# EAGLE design init_test_hall (EAGLE 8.2.2)
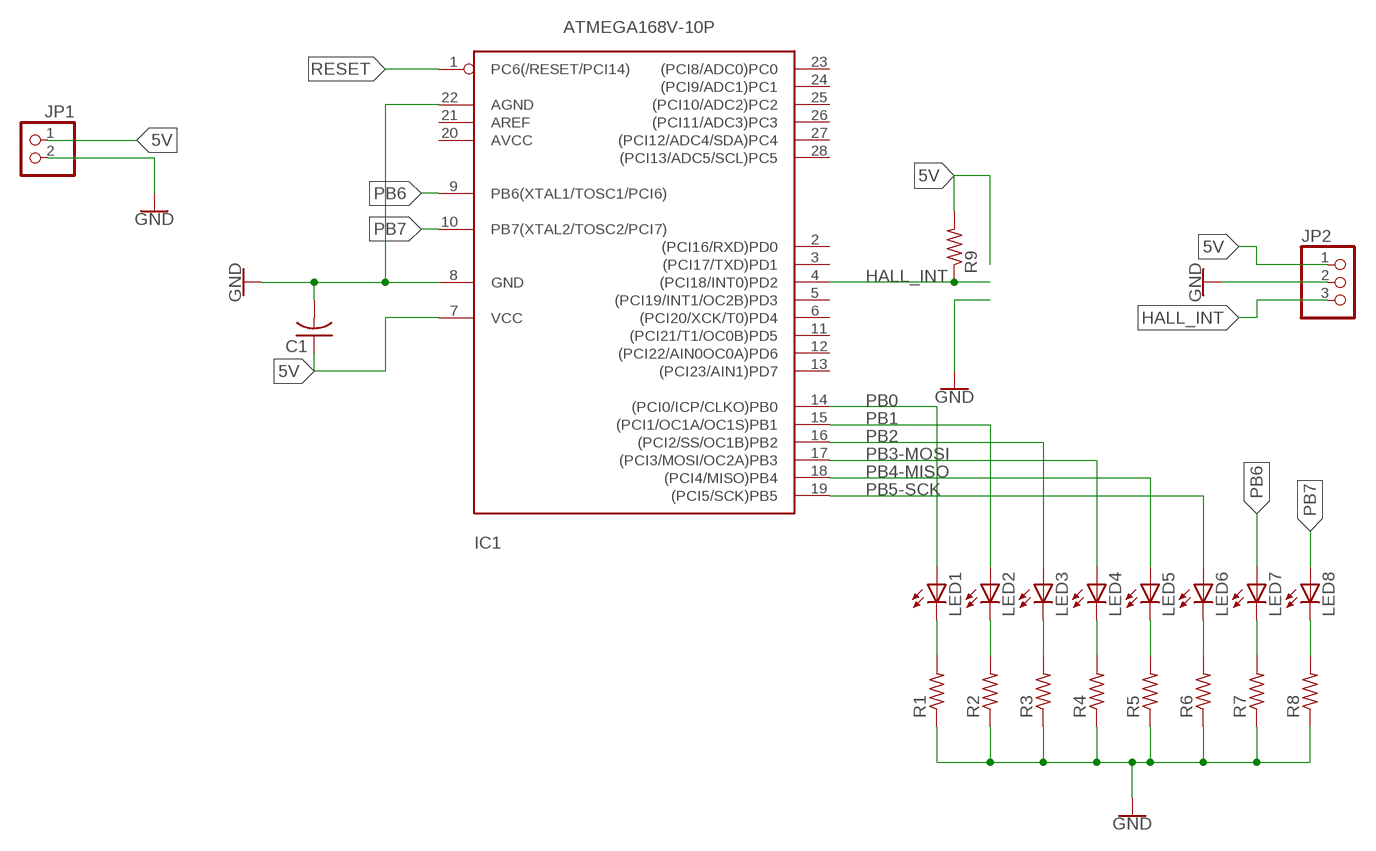
[diagram p0: schematic, sheet 1]

## Parts
C1  C-US025-030X050  [C025-030X050]
IC1  ATMEGA168V-10P  [DIL28-3]
JP1  PINHD-1X2  [1X02]
JP2  PINHD-1X3  [1X03]
LED1  LED3MM  [LED3MM]
LED2  LED3MM  [LED3MM]
LED3  LED3MM  [LED3MM]
LED4  LED3MM  [LED3MM]
LED5  LED3MM  [LED3MM]
LED6  LED3MM  [LED3MM]
LED7  LED3MM  [LED3MM]
LED8  LED3MM  [LED3MM]
R1  R-US_0207/7  [0207/7]
R2  R-US_0207/7  [0207/7]
R3  R-US_0207/7  [0207/7]
R4  R-US_0207/7  [0207/7]
R5  R-US_0207/7  [0207/7]
R6  R-US_0207/7  [0207/7]
R7  R-US_0207/7  [0207/7]
R8  R-US_0207/7  [0207/7]
R9  R-US_0207/7  [0207/7]

## Nets
5V: C1.1 IC1.7(VCC) JP1.1 JP2.1 R9.2
GND: C1.2 IC1.8(GND) IC1.22(AGND) JP1.2 JP2.2 R1.1 R2.1 R3.1 R4.1 R5.1 R6.1 R7.1 R8.1
HALL_INT: IC1.4((PCI18/INT0)PD2) JP2.3 R9.1
N$1: LED1.K(C) R1.2
N$2: LED2.K(C) R2.2
N$3: LED3.K(C) R3.2
N$4: LED4.K(C) R4.2
N$5: LED5.K(C) R5.2
N$6: LED6.K(C) R6.2
N$7: LED7.K(C) R7.2
N$8: LED8.K(C) R8.2
PB0: IC1.14((PCI0/ICP/CLKO)PB0) LED1.A
PB1: IC1.15((PCI1/OC1A/OC1S)PB1) LED2.A
PB2: IC1.16((PCI2/SS/OC1B)PB2) LED3.A
PB3-MOSI: IC1.17((PCI3/MOSI/OC2A)PB3) LED4.A
PB4-MISO: IC1.18((PCI4/MISO)PB4) LED5.A
PB5-SCK: IC1.19((PCI5/SCK)PB5) LED6.A
PB6: IC1.9(PB6(XTAL1/TOSC1/PCI6)) LED7.A
PB7: IC1.10(PB7(XTAL2/TOSC2/PCI7)) LED8.A
RESET: IC1.1(PC6(/RESET/PCI14))
Unconnected: IC1.2((PCI16/RXD)PD0) IC1.3((PCI17/TXD)PD1) IC1.5((PCI19/INT1/OC2B)PD3) IC1.6((PCI20/XCK/T0)PD4) IC1.11((PCI21/T1/OC0B)PD5) IC1.12((PCI22/AIN0OC0A)PD6) IC1.13((PCI23/AIN1)PD7) IC1.20(AVCC) IC1.21(AREF) IC1.23((PCI8/ADC0)PC0) IC1.24((PCI9/ADC1)PC1) IC1.25((PCI10/ADC2)PC2) IC1.26((PCI11/ADC3)PC3) IC1.27((PCI12/ADC4/SDA)PC4) IC1.28((PCI13/ADC5/SCL)PC5)

## Library data of the parts
C1 = adafruit:C-US: CAPACITOR, American symbol
IC1 = adafruit:ATMEGA168*P: MICROCONTROLLER 16 kBytes FLASH 1 kBytes SRAM 512 Bytes EEPROM USART 8-channel 10 bit ADC
JP1 = pinhead:PINHD-1X2: PIN HEADER
JP2 = pinhead:PINHD-1X3: PIN HEADER
LED1-LED8 = adafruit:LED: LED OSRAM: - CHIPLED LG R971, LG N971, LY N971, LG Q971, LY Q971, LO R971, LY R971 LH N974, LH R974 LS Q976, LO Q976, LY Q976 LO Q996 - Hyper CHIPLED LW Q18S LB Q993, LB Q99A, LB R99A - SideLED LS A670, LO A670, LY A670, LG A670, LP A670 LB A673, LV A673, LT A673, LW A673 LH A674 LY A675 LS A676, LA A676, LO A676, LY A676, LW A676 LS A679, LY A679, LG A679 - Hyper Micro SIDELED® LS Y876, LA Y876, LO Y876, LY Y876 LT Y87S - SmartLED LW L88C, LW L88S LB L89C, LB L89S, LG L890 LS L89K, LO L89K, LY L89K LS L896, LA L896, LO L896, LY L896 - TOPLED LS T670, LO T670, LY T670, LG T670, LP T670 LSG T670, LSP T670, LSY T670, LOP T670, LYG T670 LG T671, LOG T671, LSG T671 LB T673, LV T673, LT T673, LW T673 LH T674 LS T676, LA T676, LO T676, LY T676, LB T676, LH T676, LSB T676, LW T676 LB T67C, LV T67C, LT T67C, LS T67K, LO T67K, LY T67K, LW E67C LS E67B, LA E67B, LO E67B, LY E67B, LB E67C, LV E67C, LT E67C LW T67C LS T679, LY T679, LG T679 LS T770, LO T770, LY T770, LG T770, LP T770 LB T773, LV T773, LT T773, LW T773 LH T774 LS E675, LA E675, LY E675, LS T675 LS T776, LA T776, LO T776, LY T776, LB T776 LHGB T686 LT T68C, LB T68C - Hyper Mini TOPLED® LB M676 - Mini TOPLED Santana® LG M470 LS M47K, LO M47K, LY M47K Source: http://www.osram.convergy.de/
R1-R9 = adafruit:R-US_: RESISTOR, American symbol

## Board
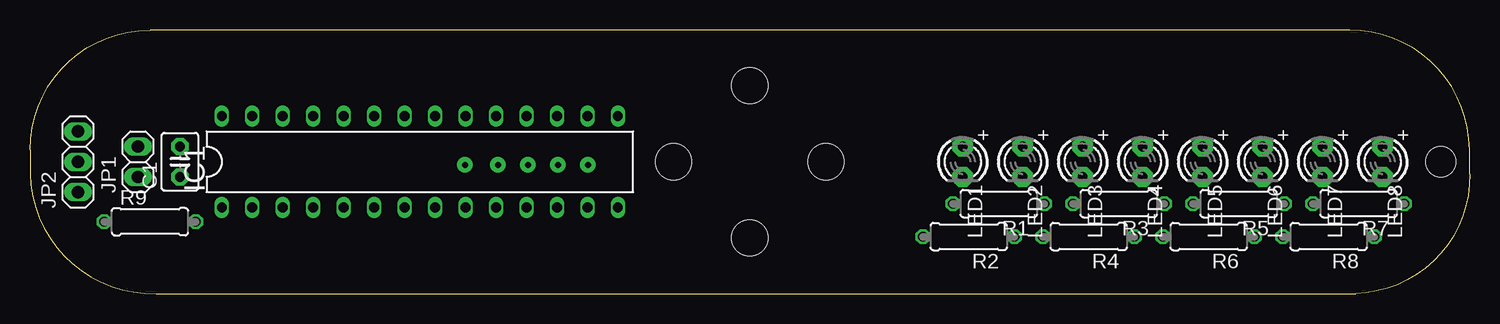
[diagram p1: board, top side]
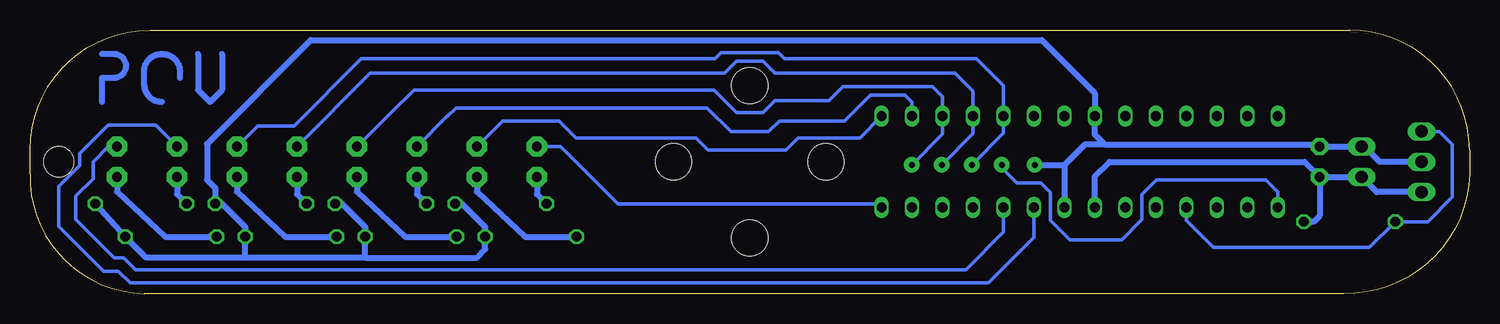
[diagram p2: board, bottom side, seen from below]

Size 120 x 22 mm. Coordinates in mm from the lower left corner, seen from the top.
Outline: 10.5,0 110.5,0 arc90 120,10 120,12 arc90 110,22 10,22 arc90 0,12 0,10 arc90 10.5,0
Copper layers (1*16): Top 0.035mm / dielectric 1.5mm / Bottom 0.035mm
Design rules "OthermillDRC_1_64_v2": minimum track width 16mil, minimum drill 31mil, track to track 0.39878125mm, track to pad 0.39878125mm, pad to pad 0.39878125mm, via to via 0.39878125mm, smd to smd 0mil, copper to edge 0mil, drill to drill 1mil, minimum pad ring 0mil, minimum via ring 15mil, stop-mask expansion 1mil, vias tented up to drill 30mil, thermal gap 10mil
Holes 3 mm at 60,4.65 60,17.35 66.35,11 53.65,11
Holes 2.5 mm at 117.6,11

### Footprints (pad centres in the part's own frame; a part is rotated, then mirrored left to right if it is on the bottom)
C025-030X050 = drill 0.813 pad 1.422 octagon: 1 -1.27,0; 2 1.27,0
DIL28-3 = drill 0.813 long: 1 -16.51,-3.81; 2 -13.97,-3.81; 3 -11.43,-3.81; 4 -8.89,-3.81; 5 -6.35,-3.81; 6 -3.81,-3.81; 7 -1.27,-3.81; 8 1.27,-3.81; 9 3.81,-3.81; 10 6.35,-3.81; 11 8.89,-3.81; 12 11.43,-3.81; 13 13.97,-3.81; 14 16.51,-3.81; 15 16.51,3.81; 16 13.97,3.81; 17 11.43,3.81; 18 8.89,3.81; 19 6.35,3.81; 20 3.81,3.81; 21 1.27,3.81; 22 -1.27,3.81; 23 -3.81,3.81; 24 -6.35,3.81; 25 -8.89,3.81; 26 -11.43,3.81; 27 -13.97,3.81; 28 -16.51,3.81
1X02 = drill 1.016 long: 1 -1.27,0; 2 1.27,0
1X03 = drill 1.016 long: 1 -2.54,0; 2 0,0; 3 2.54,0
LED3MM = drill 0.813 pad 1.676 octagon: A -1.27,0; K 1.27,0
0207/7 = drill 0.813 octagon: 1 -3.81,0; 2 3.81,0

### Placement (x,y rotation side)
C1  12.5,11 90 top
IC1  32.5,11 0 top
JP1  9,11 90 top
JP2  4,11 90 top
LED1  77.75,11 270 top
LED2  82.75,11 270 top
LED3  87.75,11 270 top
LED4  92.75,11 270 top
LED5  97.75,11 270 top
LED6  102.75,11 270 top
LED7  107.75,11 270 top
LED8  112.75,11 270 top
R1  80.75,7.5 180 top
R2  78.25,4.75 180 top
R3  90.75,7.5 180 top
R4  88.25,4.75 180 top
R5  100.75,7.5 180 top
R6  98.25,4.75 180 top
R7  110.75,7.5 180 top
R8  108.25,4.75 180 top
R9  10,6 0 top

### Tracks (layer width: path | path; a pad name or v marks a point on that pad's centre or on a via)
5V
  Bottom 0.508: C1.1 JP1.1 7.73,8.46 JP2.1 | C1.1 12.5,6.5 13,6 R9.2 | 31.23,7.77 IC1.7 31.23,9.77 30,11 13.77,11 C1.1
GND  (via drill 0.5)
  Bottom 0.508: 33.77,10.72 IC1.8 | 33.77,10.72 33.77,10.73 | JP2.2 7.5,11 8.77,12.27 JP1.2 C1.2 12.67,12.44 30.38,12.44 | v36.25,10.75 33.8,10.75 33.77,10.72 | R7.1 R8.1 110.31,3 102.02,3 | 102.02,3 102.06,3.04 R6.1 102.06,5.56 104,7.5 R5.1 104.56,8.81 105.25,9.5 105.25,12.5 96.6,21.15 35.65,21.15 31.23,16.73 IC1.22 31.23,13.29 30.38,12.44 | 92.04,3 82.75,3 82.06,3.69 R2.1 82.06,5.56 84,7.5 R1.1 | 92.04,3 102.02,3 | 92.04,3 92.06,3.02 R4.1 92.06,5.56 94,7.5 R3.1 | 33.77,10.72 32.05,12.44 30.38,12.44
HALL_INT
  Bottom 0.305: IC1.4 23.61,6.11 21.34,3.84 8.35,3.84 R9.1 3.5,6 1.43,8.07 1.43,12.43 2.54,13.54 JP2.3
N$1
  Bottom 0.508: LED1.K 77.75,8.31 R1.2
N$2
  Bottom 0.508: LED2.K 82.75,8.5 78.75,4.75 R2.2
N$3
  Bottom 0.508: LED3.K 87.75,8.31 R3.2
N$4
  Bottom 0.508: LED4.K 92.75,8.5 88.75,4.75 R4.2
N$5
  Bottom 0.508: LED5.K 97.75,8.31 R5.2
N$6
  Bottom 0.508: LED6.K 102.75,8.5 98.75,4.75 R6.2
N$7
  Bottom 0.508: LED7.K 107.75,8.31 R7.2
N$8
  Bottom 0.508: LED8.K 112.75,8.5 108.75,4.75 R8.2
O
  Bottom 0.508: 107.5,18 107.5,18.5 arc-90 109,20 arc-90 110.5,18.5 110.5,17.5 arc-90 109,16
P
  Bottom 0.508: 114,16 114,18 113,18 arc-90 112,19 arc-90 113,20 114,20
PB0
  Bottom 0.305: LED1.A 75.77,12.27 71,7.5 49.32,7.5 IC1.14
PB1
  Bottom 0.305: IC1.15 50.82,13 56,13 57,12 63.5,12 64.5,13 74.5,13 75.9,14.4 80.62,14.4 LED2.A
PB2
  Bottom 0.305: LED3.A 85.22,14.8 85.2,14.8 84.5,15.5 63.55,15.5 61.57,13.51 58.43,13.51 57.54,14.41 52.09,14.41 49.92,16.58 47.08,16.58 46.47,15.97 IC1.16
PB3-MOSI  (via drill 0.5)
  Bottom 0.305: LED4.A 89.91,15.11 89.89,15.11 88,17 63,17 61.11,15.11 58.89,15.11 57.89,16.11 53.38,16.11 52.21,17.28 44.78,17.28 43.93,16.43 IC1.17 43.93,13.32 v46.5,10.75
PB4-MISO  (via drill 0.5)
  Bottom 0.305: LED5.A 91.62,18.39 62.1,18.39 61.1,19.39 58.9,19.39 57.9,18.39 42.9,18.39 41.39,16.89 IC1.18 41.39,13.36 v44,10.75
PB5-SCK  (via drill 0.5)
  Bottom 0.305: LED6.A 101.02,14 97.98,14 92.39,19.6 62.9,19.6 62.4,20.1 57.6,20.1 57.1,19.6 41.1,19.6 38.85,17.35 IC1.19 38.85,13.4 v41.5,10.75
PB6
  Bottom 0.305: LED7.A 109.53,14.05 113.49,14.05 115.85,11.7 115.85,10.71 117.6,8.96 117.6,5.6 113.87,1.87 112.63,1.87 111.66,0.9 40.1,0.9 36.31,4.69 IC1.9
PB7
  Bottom 0.305: LED8.A 113.48,12.27 114.75,11 114.75,9.58 116.17,8.17 116.17,6.17 112.97,2.97 112.17,2.97 111.53,2.33 | IC1.10 38.85,5.15 42,2 111.2,2 111.53,2.33 | 111.53,2.33
RESET  (via drill 0.5)
  Bottom 0.305: IC1.1 15.99,8.49 17,9.5 26.09,9.5 27.31,8.28 27.31,6.19 29,4.5 33.33,4.5 34.93,6.1 34.93,8.43 35.75,9.25 37.75,9.25 39,10.5 v39,10.75
V
  Bottom 0.508: 106,20 106,17 105,16 104,17 104,20